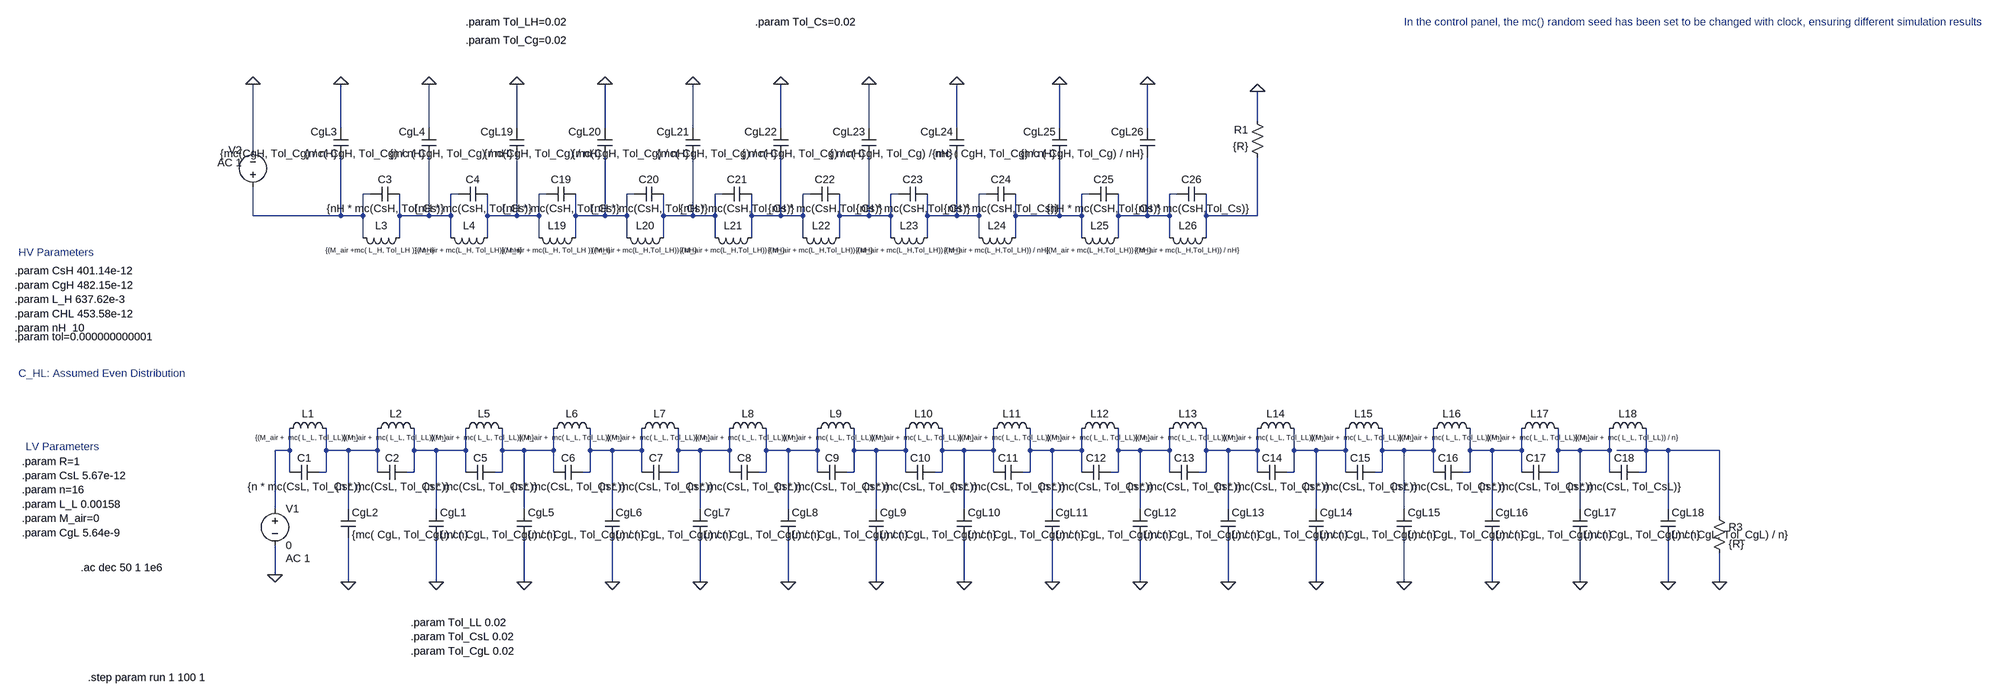
[diagram p0: schematic lumped_network_Base.asc]
lumped_network_Base.asc, the LTspice schematic file:
Version 4.1
SHEET 1 4316 1028
WIRE 2608 -576 2608 -640
WIRE 608 -560 608 -656
WIRE 800 -560 800 -656
WIRE 992 -560 992 -656
WIRE 1184 -560 1184 -656
WIRE 1376 -560 1376 -656
WIRE 1568 -560 1568 -656
WIRE 1760 -560 1760 -656
WIRE 1952 -560 1952 -656
WIRE 2176 -560 2176 -656
WIRE 2368 -560 2368 -656
WIRE 416 -512 416 -656
WIRE 672 -416 656 -416
WIRE 864 -416 848 -416
WIRE 1056 -416 1040 -416
WIRE 1248 -416 1232 -416
WIRE 1440 -416 1424 -416
WIRE 1632 -416 1616 -416
WIRE 1824 -416 1808 -416
WIRE 2016 -416 2000 -416
WIRE 2240 -416 2224 -416
WIRE 2432 -416 2416 -416
WIRE 416 -368 416 -432
WIRE 608 -368 608 -496
WIRE 608 -368 416 -368
WIRE 656 -368 656 -416
WIRE 656 -368 608 -368
WIRE 736 -368 736 -416
WIRE 800 -368 800 -496
WIRE 800 -368 736 -368
WIRE 848 -368 848 -416
WIRE 848 -368 800 -368
WIRE 928 -368 928 -416
WIRE 992 -368 992 -496
WIRE 992 -368 928 -368
WIRE 1040 -368 1040 -416
WIRE 1040 -368 992 -368
WIRE 1120 -368 1120 -416
WIRE 1184 -368 1184 -496
WIRE 1184 -368 1120 -368
WIRE 1232 -368 1232 -416
WIRE 1232 -368 1184 -368
WIRE 1312 -368 1312 -416
WIRE 1376 -368 1376 -496
WIRE 1376 -368 1312 -368
WIRE 1424 -368 1424 -416
WIRE 1424 -368 1376 -368
WIRE 1504 -368 1504 -416
WIRE 1568 -368 1568 -496
WIRE 1568 -368 1504 -368
WIRE 1616 -368 1616 -416
WIRE 1616 -368 1568 -368
WIRE 1696 -368 1696 -416
WIRE 1760 -368 1760 -496
WIRE 1760 -368 1696 -368
WIRE 1808 -368 1808 -416
WIRE 1808 -368 1760 -368
WIRE 1888 -368 1888 -416
WIRE 1952 -368 1952 -496
WIRE 1952 -368 1888 -368
WIRE 2000 -368 2000 -416
WIRE 2000 -368 1952 -368
WIRE 2080 -368 2080 -416
WIRE 2176 -368 2176 -496
WIRE 2176 -368 2080 -368
WIRE 2224 -368 2224 -416
WIRE 2224 -368 2176 -368
WIRE 2304 -368 2304 -416
WIRE 2368 -368 2368 -496
WIRE 2368 -368 2304 -368
WIRE 2416 -368 2416 -416
WIRE 2416 -368 2368 -368
WIRE 2496 -368 2496 -416
WIRE 2608 -368 2608 -496
WIRE 2608 -368 2496 -368
WIRE 656 -320 656 -368
WIRE 736 -320 736 -368
WIRE 848 -320 848 -368
WIRE 928 -320 928 -368
WIRE 1040 -320 1040 -368
WIRE 1120 -320 1120 -368
WIRE 1232 -320 1232 -368
WIRE 1312 -320 1312 -368
WIRE 1424 -320 1424 -368
WIRE 1504 -320 1504 -368
WIRE 1616 -320 1616 -368
WIRE 1696 -320 1696 -368
WIRE 1808 -320 1808 -368
WIRE 1888 -320 1888 -368
WIRE 2000 -320 2000 -368
WIRE 2080 -320 2080 -368
WIRE 2224 -320 2224 -368
WIRE 2304 -320 2304 -368
WIRE 2416 -320 2416 -368
WIRE 2496 -320 2496 -368
WIRE 496 144 496 96
WIRE 496 144 464 144
WIRE 576 144 576 96
WIRE 624 144 576 144
WIRE 688 144 688 96
WIRE 688 144 624 144
WIRE 768 144 768 96
WIRE 816 144 768 144
WIRE 880 144 880 96
WIRE 880 144 816 144
WIRE 960 144 960 96
WIRE 1008 144 960 144
WIRE 1072 144 1072 96
WIRE 1072 144 1008 144
WIRE 1152 144 1152 96
WIRE 1200 144 1152 144
WIRE 1264 144 1264 96
WIRE 1264 144 1200 144
WIRE 1344 144 1344 96
WIRE 1392 144 1344 144
WIRE 1456 144 1456 96
WIRE 1456 144 1392 144
WIRE 1536 144 1536 96
WIRE 1584 144 1536 144
WIRE 1648 144 1648 96
WIRE 1648 144 1584 144
WIRE 1728 144 1728 96
WIRE 1776 144 1728 144
WIRE 1840 144 1840 96
WIRE 1840 144 1776 144
WIRE 1920 144 1920 96
WIRE 1968 144 1920 144
WIRE 2032 144 2032 96
WIRE 2032 144 1968 144
WIRE 2112 144 2112 96
WIRE 2160 144 2112 144
WIRE 2224 144 2224 96
WIRE 2224 144 2160 144
WIRE 2304 144 2304 96
WIRE 2352 144 2304 144
WIRE 2416 144 2416 96
WIRE 2416 144 2352 144
WIRE 2496 144 2496 96
WIRE 2544 144 2496 144
WIRE 2608 144 2608 96
WIRE 2608 144 2544 144
WIRE 2688 144 2688 96
WIRE 2736 144 2688 144
WIRE 2800 144 2800 96
WIRE 2800 144 2736 144
WIRE 2880 144 2880 96
WIRE 2928 144 2880 144
WIRE 2992 144 2992 96
WIRE 2992 144 2928 144
WIRE 3072 144 3072 96
WIRE 3120 144 3072 144
WIRE 3184 144 3184 96
WIRE 3184 144 3120 144
WIRE 3264 144 3264 96
WIRE 3312 144 3264 144
WIRE 3376 144 3376 96
WIRE 3376 144 3312 144
WIRE 3456 144 3456 96
WIRE 3456 144 3392 144
WIRE 3504 144 3456 144
WIRE 3616 144 3504 144
WIRE 496 192 496 144
WIRE 576 192 576 144
WIRE 576 192 560 192
WIRE 688 192 688 144
WIRE 768 192 768 144
WIRE 768 192 752 192
WIRE 880 192 880 144
WIRE 960 192 960 144
WIRE 960 192 944 192
WIRE 1072 192 1072 144
WIRE 1152 192 1152 144
WIRE 1152 192 1136 192
WIRE 1264 192 1264 144
WIRE 1344 192 1344 144
WIRE 1344 192 1328 192
WIRE 1456 192 1456 144
WIRE 1536 192 1536 144
WIRE 1536 192 1520 192
WIRE 1648 192 1648 144
WIRE 1728 192 1728 144
WIRE 1728 192 1712 192
WIRE 1840 192 1840 144
WIRE 1920 192 1920 144
WIRE 1920 192 1904 192
WIRE 2032 192 2032 144
WIRE 2112 192 2112 144
WIRE 2112 192 2096 192
WIRE 2224 192 2224 144
WIRE 2304 192 2304 144
WIRE 2304 192 2288 192
WIRE 2416 192 2416 144
WIRE 2496 192 2496 144
WIRE 2496 192 2480 192
WIRE 2608 192 2608 144
WIRE 2688 192 2688 144
WIRE 2688 192 2672 192
WIRE 2800 192 2800 144
WIRE 2880 192 2880 144
WIRE 2880 192 2864 192
WIRE 2992 192 2992 144
WIRE 3072 192 3072 144
WIRE 3072 192 3056 192
WIRE 3184 192 3184 144
WIRE 3264 192 3264 144
WIRE 3264 192 3248 192
WIRE 3376 192 3376 144
WIRE 3456 192 3456 144
WIRE 3456 192 3440 192
WIRE 464 272 464 144
WIRE 624 272 624 144
WIRE 816 272 816 144
WIRE 1008 272 1008 144
WIRE 1200 272 1200 144
WIRE 1392 272 1392 144
WIRE 1584 272 1584 144
WIRE 1776 272 1776 144
WIRE 1968 272 1968 144
WIRE 2160 272 2160 144
WIRE 2352 272 2352 144
WIRE 2544 272 2544 144
WIRE 2736 272 2736 144
WIRE 2928 272 2928 144
WIRE 3120 272 3120 144
WIRE 3312 272 3312 144
WIRE 3504 272 3504 144
WIRE 3616 288 3616 144
WIRE 464 416 464 352
WIRE 624 432 624 336
WIRE 816 432 816 336
WIRE 1008 432 1008 336
WIRE 1200 432 1200 336
WIRE 1392 432 1392 336
WIRE 1584 432 1584 336
WIRE 1776 432 1776 336
WIRE 1968 432 1968 336
WIRE 2160 432 2160 336
WIRE 2352 432 2352 336
WIRE 2544 432 2544 336
WIRE 2736 432 2736 336
WIRE 2928 432 2928 336
WIRE 3120 432 3120 336
WIRE 3312 432 3312 336
WIRE 3504 432 3504 336
WIRE 3616 432 3616 368
FLAG 464 416 0
FLAG 624 432 0
FLAG 3616 432 0
FLAG 608 -656 0
FLAG 2608 -640 0
FLAG 800 -656 0
FLAG 992 -656 0
FLAG 1184 -656 0
FLAG 1376 -656 0
FLAG 1568 -656 0
FLAG 1760 -656 0
FLAG 1952 -656 0
FLAG 2176 -656 0
FLAG 2368 -656 0
FLAG 416 -656 0
FLAG 816 432 0
FLAG 1008 432 0
FLAG 1200 432 0
FLAG 1392 432 0
FLAG 1584 432 0
FLAG 1776 432 0
FLAG 1968 432 0
FLAG 2160 432 0
FLAG 2352 432 0
FLAG 2544 432 0
FLAG 2736 432 0
FLAG 2928 432 0
FLAG 3120 432 0
FLAG 3312 432 0
FLAG 3504 432 0
DATAFLAG 736 -400 ""
SYMBOL voltage 464 256 R0
WINDOW 123 24 124 Left 2
WINDOW 39 0 0 Left 0
SYMATTR Value2 AC 1
SYMATTR InstName V1
SYMATTR Value 0
SYMBOL cap 560 176 R90
WINDOW 0 0 32 VBottom 2
WINDOW 3 32 32 VTop 2
SYMATTR InstName C1
SYMATTR Value {n * mc(CsL, Tol_CsL)}
SYMBOL ind 480 112 R270
WINDOW 0 32 56 VTop 2
WINDOW 3 -14 56 VTop 1
SYMATTR InstName L1
SYMATTR Value {(M_air +  mc( L_L, Tol_LL)) / n}
SYMBOL cap 608 272 R0
SYMATTR InstName CgL2
SYMATTR Value {mc( CgL, Tol_CgL) / n}
SYMBOL res 3600 272 R0
SYMATTR InstName R3
SYMATTR Value {R}
SYMBOL res 2624 -480 R180
WINDOW 0 36 76 Left 2
WINDOW 3 36 40 Left 2
SYMATTR InstName R1
SYMATTR Value {R}
SYMBOL cap 672 -400 R270
WINDOW 0 32 32 VTop 2
WINDOW 3 0 32 VBottom 2
SYMATTR InstName C3
SYMATTR Value {nH * mc(CsH, Tol_Cs)}
SYMBOL ind 752 -336 R90
WINDOW 0 5 56 VBottom 2
WINDOW 3 32 56 VTop 1
SYMATTR InstName L3
SYMATTR Value {(M_air +mc( L_H, Tol_LH )) / nH}
SYMBOL cap 624 -496 R180
WINDOW 0 24 56 Left 2
WINDOW 3 24 8 Left 2
SYMATTR InstName CgL3
SYMATTR Value {mc(CgH, Tol_Cg) / nH}
SYMBOL cap 864 -400 R270
WINDOW 0 32 32 VTop 2
WINDOW 3 0 32 VBottom 2
SYMATTR InstName C4
SYMATTR Value {nH * mc(CsH, Tol_Cs)}
SYMBOL ind 944 -336 R90
WINDOW 0 5 56 VBottom 2
WINDOW 3 32 56 VTop 1
SYMATTR InstName L4
SYMATTR Value {(M_air + mc(L_H, Tol_LH)) / nH}
SYMBOL cap 816 -496 R180
WINDOW 0 24 56 Left 2
WINDOW 3 24 8 Left 2
SYMATTR InstName CgL4
SYMATTR Value {mc( CgH, Tol_Cg) / nH}
SYMBOL cap 1056 -400 R270
WINDOW 0 32 32 VTop 2
WINDOW 3 0 32 VBottom 2
SYMATTR InstName C19
SYMATTR Value {nH * mc(CsH, Tol_Cs)}
SYMBOL ind 1136 -336 R90
WINDOW 0 5 56 VBottom 2
WINDOW 3 32 56 VTop 1
SYMATTR InstName L19
SYMATTR Value {(M_air + mc(L_H, Tol_LH )) / nH}
SYMBOL cap 1008 -496 R180
WINDOW 0 24 56 Left 2
WINDOW 3 24 8 Left 2
SYMATTR InstName CgL19
SYMATTR Value {mc ( CgH, Tol_Cg) / nH}
SYMBOL cap 1248 -400 R270
WINDOW 0 32 32 VTop 2
WINDOW 3 0 32 VBottom 2
SYMATTR InstName C20
SYMATTR Value {nH * mc(CsH, Tol_Cs)}
SYMBOL ind 1328 -336 R90
WINDOW 0 5 56 VBottom 2
WINDOW 3 32 56 VTop 1
SYMATTR InstName L20
SYMATTR Value {(M_air + mc(L_H,Tol_LH)) / nH}
SYMBOL cap 1200 -496 R180
WINDOW 0 24 56 Left 2
WINDOW 3 24 8 Left 2
SYMATTR InstName CgL20
SYMATTR Value {mc(CgH, Tol_Cg) / nH}
SYMBOL cap 1440 -400 R270
WINDOW 0 32 32 VTop 2
WINDOW 3 0 32 VBottom 2
SYMATTR InstName C21
SYMATTR Value {nH * mc(CsH,Tol_Cs)}
SYMBOL ind 1520 -336 R90
WINDOW 0 5 56 VBottom 2
WINDOW 3 32 56 VTop 1
SYMATTR InstName L21
SYMATTR Value {(M_air + mc(L_H,Tol_LH)) / nH}
SYMBOL cap 1392 -496 R180
WINDOW 0 24 56 Left 2
WINDOW 3 24 8 Left 2
SYMATTR InstName CgL21
SYMATTR Value {mc(CgH, Tol_Cg) / nH}
SYMBOL cap 1632 -400 R270
WINDOW 0 32 32 VTop 2
WINDOW 3 0 32 VBottom 2
SYMATTR InstName C22
SYMATTR Value {nH * mc(CsH,Tol_Cs)}
SYMBOL ind 1712 -336 R90
WINDOW 0 5 56 VBottom 2
WINDOW 3 32 56 VTop 1
SYMATTR InstName L22
SYMATTR Value {(M_air + mc(L_H,Tol_LH)) / nH}
SYMBOL cap 1584 -496 R180
WINDOW 0 24 56 Left 2
WINDOW 3 24 8 Left 2
SYMATTR InstName CgL22
SYMATTR Value {mc( CgH, Tol_Cg) / nH}
SYMBOL cap 1824 -400 R270
WINDOW 0 32 32 VTop 2
WINDOW 3 0 32 VBottom 2
SYMATTR InstName C23
SYMATTR Value {nH * mc(CsH,Tol_Cs)}
SYMBOL ind 1904 -336 R90
WINDOW 0 5 56 VBottom 2
WINDOW 3 32 56 VTop 1
SYMATTR InstName L23
SYMATTR Value {(M_air + mc(L_H,Tol_LH)) / nH}
SYMBOL cap 1776 -496 R180
WINDOW 0 24 56 Left 2
WINDOW 3 24 8 Left 2
SYMATTR InstName CgL23
SYMATTR Value { mc( CgH, Tol_Cg) / nH}
SYMBOL cap 2016 -400 R270
WINDOW 0 32 32 VTop 2
WINDOW 3 0 32 VBottom 2
SYMATTR InstName C24
SYMATTR Value {nH * mc(CsH,Tol_Cs)}
SYMBOL ind 2096 -336 R90
WINDOW 0 5 56 VBottom 2
WINDOW 3 32 56 VTop 1
SYMATTR InstName L24
SYMATTR Value {(M_air + mc(L_H,Tol_LH)) / nH}
SYMBOL cap 1968 -496 R180
WINDOW 0 24 56 Left 2
WINDOW 3 24 8 Left 2
SYMATTR InstName CgL24
SYMATTR Value { mc( CgH, Tol_Cg) / nH}
SYMBOL cap 2240 -400 R270
WINDOW 0 32 32 VTop 2
WINDOW 3 0 32 VBottom 2
SYMATTR InstName C25
SYMATTR Value {nH * mc(CsH,Tol_Cs)}
SYMBOL ind 2320 -336 R90
WINDOW 0 5 56 VBottom 2
WINDOW 3 32 56 VTop 1
SYMATTR InstName L25
SYMATTR Value {(M_air + mc(L_H,Tol_LH)) / nH}
SYMBOL cap 2192 -496 R180
WINDOW 0 24 56 Left 2
WINDOW 3 24 8 Left 2
SYMATTR InstName CgL25
SYMATTR Value {mc ( CgH, Tol_Cg) / nH}
SYMBOL cap 2432 -400 R270
WINDOW 0 32 32 VTop 2
WINDOW 3 0 32 VBottom 2
SYMATTR InstName C26
SYMATTR Value {nH * mc(CsH,Tol_Cs)}
SYMBOL ind 2512 -336 R90
WINDOW 0 5 56 VBottom 2
WINDOW 3 32 56 VTop 1
SYMATTR InstName L26
SYMATTR Value {(M_air + mc(L_H,Tol_LH)) / nH}
SYMBOL cap 2384 -496 R180
WINDOW 0 24 56 Left 2
WINDOW 3 24 8 Left 2
SYMATTR InstName CgL26
SYMATTR Value {mc ( CgH, Tol_Cg) / nH}
SYMBOL voltage 416 -416 R180
WINDOW 0 24 96 Left 2
WINDOW 3 24 16 Left 2
WINDOW 123 24 68 Left 2
WINDOW 39 0 0 Left 0
SYMATTR InstName V2
SYMATTR Value ""
SYMATTR Value2 AC 1
SYMBOL cap 752 176 R90
WINDOW 0 0 32 VBottom 2
WINDOW 3 32 32 VTop 2
SYMATTR InstName C2
SYMATTR Value {n * mc(CsL, Tol_CsL)}
SYMBOL ind 672 112 R270
WINDOW 0 32 56 VTop 2
WINDOW 3 -14 56 VTop 1
SYMATTR InstName L2
SYMATTR Value {(M_air +  mc( L_L, Tol_LL)) / n}
SYMBOL cap 800 272 R0
SYMATTR InstName CgL1
SYMATTR Value {mc( CgL, Tol_CgL) / n}
SYMBOL cap 944 176 R90
WINDOW 0 0 32 VBottom 2
WINDOW 3 32 32 VTop 2
SYMATTR InstName C5
SYMATTR Value {n * mc(CsL, Tol_CsL)}
SYMBOL ind 864 112 R270
WINDOW 0 32 56 VTop 2
WINDOW 3 -14 56 VTop 1
SYMATTR InstName L5
SYMATTR Value {(M_air +  mc( L_L, Tol_LL)) / n}
SYMBOL cap 992 272 R0
SYMATTR InstName CgL5
SYMATTR Value {mc( CgL, Tol_CgL) / n}
SYMBOL cap 1136 176 R90
WINDOW 0 0 32 VBottom 2
WINDOW 3 32 32 VTop 2
SYMATTR InstName C6
SYMATTR Value {n * mc(CsL, Tol_CsL)}
SYMBOL ind 1056 112 R270
WINDOW 0 32 56 VTop 2
WINDOW 3 -14 56 VTop 1
SYMATTR InstName L6
SYMATTR Value {(M_air +  mc( L_L, Tol_LL)) / n}
SYMBOL cap 1184 272 R0
SYMATTR InstName CgL6
SYMATTR Value {mc( CgL, Tol_CgL) / n}
SYMBOL cap 1328 176 R90
WINDOW 0 0 32 VBottom 2
WINDOW 3 32 32 VTop 2
SYMATTR InstName C7
SYMATTR Value {n * mc(CsL, Tol_CsL)}
SYMBOL ind 1248 112 R270
WINDOW 0 32 56 VTop 2
WINDOW 3 -14 56 VTop 1
SYMATTR InstName L7
SYMATTR Value {(M_air +  mc( L_L, Tol_LL)) / n}
SYMBOL cap 1376 272 R0
SYMATTR InstName CgL7
SYMATTR Value {mc( CgL, Tol_CgL) / n}
SYMBOL cap 1520 176 R90
WINDOW 0 0 32 VBottom 2
WINDOW 3 32 32 VTop 2
SYMATTR InstName C8
SYMATTR Value {n * mc(CsL, Tol_CsL)}
SYMBOL ind 1440 112 R270
WINDOW 0 32 56 VTop 2
WINDOW 3 -14 56 VTop 1
SYMATTR InstName L8
SYMATTR Value {(M_air +  mc( L_L, Tol_LL)) / n}
SYMBOL cap 1568 272 R0
SYMATTR InstName CgL8
SYMATTR Value {mc( CgL, Tol_CgL) / n}
SYMBOL cap 1712 176 R90
WINDOW 0 0 32 VBottom 2
WINDOW 3 32 32 VTop 2
SYMATTR InstName C9
SYMATTR Value {n * mc(CsL, Tol_CsL)}
SYMBOL ind 1632 112 R270
WINDOW 0 32 56 VTop 2
WINDOW 3 -14 56 VTop 1
SYMATTR InstName L9
SYMATTR Value {(M_air +  mc( L_L, Tol_LL)) / n}
SYMBOL cap 1760 272 R0
SYMATTR InstName CgL9
SYMATTR Value {mc( CgL, Tol_CgL) / n}
SYMBOL cap 1904 176 R90
WINDOW 0 0 32 VBottom 2
WINDOW 3 32 32 VTop 2
SYMATTR InstName C10
SYMATTR Value {n * mc(CsL, Tol_CsL)}
SYMBOL ind 1824 112 R270
WINDOW 0 32 56 VTop 2
WINDOW 3 -14 56 VTop 1
SYMATTR InstName L10
SYMATTR Value {(M_air +  mc( L_L, Tol_LL)) / n}
SYMBOL cap 1952 272 R0
SYMATTR InstName CgL10
SYMATTR Value {mc( CgL, Tol_CgL) / n}
SYMBOL cap 2096 176 R90
WINDOW 0 0 32 VBottom 2
WINDOW 3 32 32 VTop 2
SYMATTR InstName C11
SYMATTR Value {n * mc(CsL, Tol_CsL)}
SYMBOL ind 2016 112 R270
WINDOW 0 32 56 VTop 2
WINDOW 3 -14 56 VTop 1
SYMATTR InstName L11
SYMATTR Value {(M_air +  mc( L_L, Tol_LL)) / n}
SYMBOL cap 2144 272 R0
SYMATTR InstName CgL11
SYMATTR Value {mc( CgL, Tol_CgL) / n}
SYMBOL cap 2288 176 R90
WINDOW 0 0 32 VBottom 2
WINDOW 3 32 32 VTop 2
SYMATTR InstName C12
SYMATTR Value {n * mc(CsL, Tol_CsL)}
SYMBOL ind 2208 112 R270
WINDOW 0 32 56 VTop 2
WINDOW 3 -14 56 VTop 1
SYMATTR InstName L12
SYMATTR Value {(M_air +  mc( L_L, Tol_LL)) / n}
SYMBOL cap 2336 272 R0
SYMATTR InstName CgL12
SYMATTR Value {mc( CgL, Tol_CgL) / n}
SYMBOL cap 2480 176 R90
WINDOW 0 0 32 VBottom 2
WINDOW 3 32 32 VTop 2
SYMATTR InstName C13
SYMATTR Value {n * mc(CsL, Tol_CsL)}
SYMBOL ind 2400 112 R270
WINDOW 0 32 56 VTop 2
WINDOW 3 -14 56 VTop 1
SYMATTR InstName L13
SYMATTR Value {(M_air +  mc( L_L, Tol_LL)) / n}
SYMBOL cap 2528 272 R0
SYMATTR InstName CgL13
SYMATTR Value {mc( CgL, Tol_CgL) / n}
SYMBOL cap 2672 176 R90
WINDOW 0 0 32 VBottom 2
WINDOW 3 32 32 VTop 2
SYMATTR InstName C14
SYMATTR Value {n * mc(CsL, Tol_CsL)}
SYMBOL ind 2592 112 R270
WINDOW 0 32 56 VTop 2
WINDOW 3 -14 56 VTop 1
SYMATTR InstName L14
SYMATTR Value {(M_air +  mc( L_L, Tol_LL)) / n}
SYMBOL cap 2720 272 R0
SYMATTR InstName CgL14
SYMATTR Value {mc( CgL, Tol_CgL) / n}
SYMBOL cap 2864 176 R90
WINDOW 0 0 32 VBottom 2
WINDOW 3 32 32 VTop 2
SYMATTR InstName C15
SYMATTR Value {n * mc(CsL, Tol_CsL)}
SYMBOL ind 2784 112 R270
WINDOW 0 32 56 VTop 2
WINDOW 3 -14 56 VTop 1
SYMATTR InstName L15
SYMATTR Value {(M_air +  mc( L_L, Tol_LL)) / n}
SYMBOL cap 2912 272 R0
SYMATTR InstName CgL15
SYMATTR Value {mc( CgL, Tol_CgL) / n}
SYMBOL cap 3056 176 R90
WINDOW 0 0 32 VBottom 2
WINDOW 3 32 32 VTop 2
SYMATTR InstName C16
SYMATTR Value {n * mc(CsL, Tol_CsL)}
SYMBOL ind 2976 112 R270
WINDOW 0 32 56 VTop 2
WINDOW 3 -14 56 VTop 1
SYMATTR InstName L16
SYMATTR Value {(M_air +  mc( L_L, Tol_LL)) / n}
SYMBOL cap 3104 272 R0
SYMATTR InstName CgL16
SYMATTR Value {mc( CgL, Tol_CgL) / n}
SYMBOL cap 3248 176 R90
WINDOW 0 0 32 VBottom 2
WINDOW 3 32 32 VTop 2
SYMATTR InstName C17
SYMATTR Value {n * mc(CsL, Tol_CsL)}
SYMBOL ind 3168 112 R270
WINDOW 0 32 56 VTop 2
WINDOW 3 -14 56 VTop 1
SYMATTR InstName L17
SYMATTR Value {(M_air +  mc( L_L, Tol_LL)) / n}
SYMBOL cap 3296 272 R0
SYMATTR InstName CgL17
SYMATTR Value {mc( CgL, Tol_CgL) / n}
SYMBOL cap 3440 176 R90
WINDOW 0 0 32 VBottom 2
WINDOW 3 32 32 VTop 2
SYMATTR InstName C18
SYMATTR Value {n * mc(CsL, Tol_CsL)}
SYMBOL ind 3360 112 R270
WINDOW 0 32 56 VTop 2
WINDOW 3 -14 56 VTop 1
SYMATTR InstName L18
SYMATTR Value {(M_air +  mc( L_L, Tol_LL)) / n}
SYMBOL cap 3488 272 R0
SYMATTR InstName CgL18
SYMATTR Value {mc( CgL, Tol_CgL) / n}
TEXT 40 400 Left 2 !.ac dec 50 1 1e6
TEXT -88 168 Left 2 !.param R=1\n.param CsL 5.67e-12\n.param n=16\n.param L_L 0.00158\n.param M_air=0\n.param CgL 5.64e-9
TEXT -104 -248 Left 2 !.param CsH 401.14e-12\n.param CgH 482.15e-12\n.param L_H 637.62e-3\n.param CHL 453.58e-12\n.param nH  10
TEXT -96 -288 Left 2 ;HV Parameters
TEXT -96 -24 Left 2 ;C_HL: Assumed Even Distribution
TEXT -80 136 Left 2 ;LV Parameters
TEXT 56 640 Left 2 !.step param run 1 100 1
TEXT -104 -104 Left 2 !.param tol=0.000000000001
TEXT 880 -752 Left 2 !.param Tol_Cg=0.02
TEXT 880 -792 Left 2 !.param Tol_LH=0.02
TEXT 1512 -792 Left 2 !.param Tol_Cs=0.02
TEXT 760 520 Left 2 !.param Tol_LL 0.02\n.param Tol_CsL 0.02\n.param Tol_CgL 0.02
TEXT 2928 -792 Left 2 ;In the control panel, the mc() random seed has been set to be changed with clock, ensuring different simulation results

The netlist it stands for:
* lumped_network_Base.asc
V1 N012 0 0 AC 1
C1 N013 N012 {n * mc(CsL, Tol_CsL)}
L1 N012 N013 {(M_air +  mc( L_L, Tol_LL)) / n}
CgL2 N013 0 {mc( CgL, Tol_CgL) / n}
R3 N028 0 {R}
R1 N011 0 {R}
C3 N001 N002 {nH * mc(CsH, Tol_Cs)}
L3 N002 N001 {(M_air +mc( L_H, Tol_LH )) / nH}
CgL3 N001 0 {mc(CgH, Tol_Cg) / nH}
C4 N002 N003 {nH * mc(CsH, Tol_Cs)}
L4 N003 N002 {(M_air + mc(L_H, Tol_LH)) / nH}
CgL4 N002 0 {mc( CgH, Tol_Cg) / nH}
C19 N003 N004 {nH * mc(CsH, Tol_Cs)}
L19 N004 N003 {(M_air + mc(L_H, Tol_LH )) / nH}
CgL19 N003 0 {mc ( CgH, Tol_Cg) / nH}
C20 N004 N005 {nH * mc(CsH, Tol_Cs)}
L20 N005 N004 {(M_air + mc(L_H,Tol_LH)) / nH}
CgL20 N004 0 {mc(CgH, Tol_Cg) / nH}
C21 N005 N006 {nH * mc(CsH,Tol_Cs)}
L21 N006 N005 {(M_air + mc(L_H,Tol_LH)) / nH}
CgL21 N005 0 {mc(CgH, Tol_Cg) / nH}
C22 N006 N007 {nH * mc(CsH,Tol_Cs)}
L22 N007 N006 {(M_air + mc(L_H,Tol_LH)) / nH}
CgL22 N006 0 {mc( CgH, Tol_Cg) / nH}
C23 N007 N008 {nH * mc(CsH,Tol_Cs)}
L23 N008 N007 {(M_air + mc(L_H,Tol_LH)) / nH}
CgL23 N007 0 { mc( CgH, Tol_Cg) / nH}
C24 N008 N009 {nH * mc(CsH,Tol_Cs)}
L24 N009 N008 {(M_air + mc(L_H,Tol_LH)) / nH}
CgL24 N008 0 { mc( CgH, Tol_Cg) / nH}
C25 N009 N010 {nH * mc(CsH,Tol_Cs)}
L25 N010 N009 {(M_air + mc(L_H,Tol_LH)) / nH}
CgL25 N009 0 {mc ( CgH, Tol_Cg) / nH}
C26 N010 N011 {nH * mc(CsH,Tol_Cs)}
L26 N011 N010 {(M_air + mc(L_H,Tol_LH)) / nH}
CgL26 N010 0 {mc ( CgH, Tol_Cg) / nH}
V2 N001 0 AC 1
C2 N014 N013 {n * mc(CsL, Tol_CsL)}
L2 N013 N014 {(M_air +  mc( L_L, Tol_LL)) / n}
CgL1 N014 0 {mc( CgL, Tol_CgL) / n}
C5 N015 N014 {n * mc(CsL, Tol_CsL)}
L5 N014 N015 {(M_air +  mc( L_L, Tol_LL)) / n}
CgL5 N015 0 {mc( CgL, Tol_CgL) / n}
C6 N016 N015 {n * mc(CsL, Tol_CsL)}
L6 N015 N016 {(M_air +  mc( L_L, Tol_LL)) / n}
CgL6 N016 0 {mc( CgL, Tol_CgL) / n}
C7 N017 N016 {n * mc(CsL, Tol_CsL)}
L7 N016 N017 {(M_air +  mc( L_L, Tol_LL)) / n}
CgL7 N017 0 {mc( CgL, Tol_CgL) / n}
C8 N018 N017 {n * mc(CsL, Tol_CsL)}
L8 N017 N018 {(M_air +  mc( L_L, Tol_LL)) / n}
CgL8 N018 0 {mc( CgL, Tol_CgL) / n}
C9 N019 N018 {n * mc(CsL, Tol_CsL)}
L9 N018 N019 {(M_air +  mc( L_L, Tol_LL)) / n}
CgL9 N019 0 {mc( CgL, Tol_CgL) / n}
C10 N020 N019 {n * mc(CsL, Tol_CsL)}
L10 N019 N020 {(M_air +  mc( L_L, Tol_LL)) / n}
CgL10 N020 0 {mc( CgL, Tol_CgL) / n}
C11 N021 N020 {n * mc(CsL, Tol_CsL)}
L11 N020 N021 {(M_air +  mc( L_L, Tol_LL)) / n}
CgL11 N021 0 {mc( CgL, Tol_CgL) / n}
C12 N022 N021 {n * mc(CsL, Tol_CsL)}
L12 N021 N022 {(M_air +  mc( L_L, Tol_LL)) / n}
CgL12 N022 0 {mc( CgL, Tol_CgL) / n}
C13 N023 N022 {n * mc(CsL, Tol_CsL)}
L13 N022 N023 {(M_air +  mc( L_L, Tol_LL)) / n}
CgL13 N023 0 {mc( CgL, Tol_CgL) / n}
C14 N024 N023 {n * mc(CsL, Tol_CsL)}
L14 N023 N024 {(M_air +  mc( L_L, Tol_LL)) / n}
CgL14 N024 0 {mc( CgL, Tol_CgL) / n}
C15 N025 N024 {n * mc(CsL, Tol_CsL)}
L15 N024 N025 {(M_air +  mc( L_L, Tol_LL)) / n}
CgL15 N025 0 {mc( CgL, Tol_CgL) / n}
C16 N026 N025 {n * mc(CsL, Tol_CsL)}
L16 N025 N026 {(M_air +  mc( L_L, Tol_LL)) / n}
CgL16 N026 0 {mc( CgL, Tol_CgL) / n}
C17 N027 N026 {n * mc(CsL, Tol_CsL)}
L17 N026 N027 {(M_air +  mc( L_L, Tol_LL)) / n}
CgL17 N027 0 {mc( CgL, Tol_CgL) / n}
C18 N028 N027 {n * mc(CsL, Tol_CsL)}
L18 N027 N028 {(M_air +  mc( L_L, Tol_LL)) / n}
CgL18 N028 0 {mc( CgL, Tol_CgL) / n}
.ac dec 50 1 1e6
.param R=1
.param CsL 5.67e-12
.param n=16
.param L_L 0.00158
.param M_air=0
.param CgL 5.64e-9
.param CsH 401.14e-12
.param CgH 482.15e-12
.param L_H 637.62e-3
.param CHL 453.58e-12
.param nH  10
* HV Parameters
* C_HL: Assumed Even Distribution
* LV Parameters
.step param run 1 100 1
.param tol=0.000000000001
.param Tol_Cg=0.02
.param Tol_LH=0.02
.param Tol_Cs=0.02
.param Tol_LL 0.02
.param Tol_CsL 0.02
.param Tol_CgL 0.02
* In the control panel, the mc() random seed has been set to be changed with clock, ensuring different simulation results
.backanno
.end